# Altium schematic sheet power_supply.SchDoc: Triumvi - Power supply
size Letter; Author: Ye-Sheng Kuo; Revision: 12; SheetNumber: 2; SheetTotal: 9
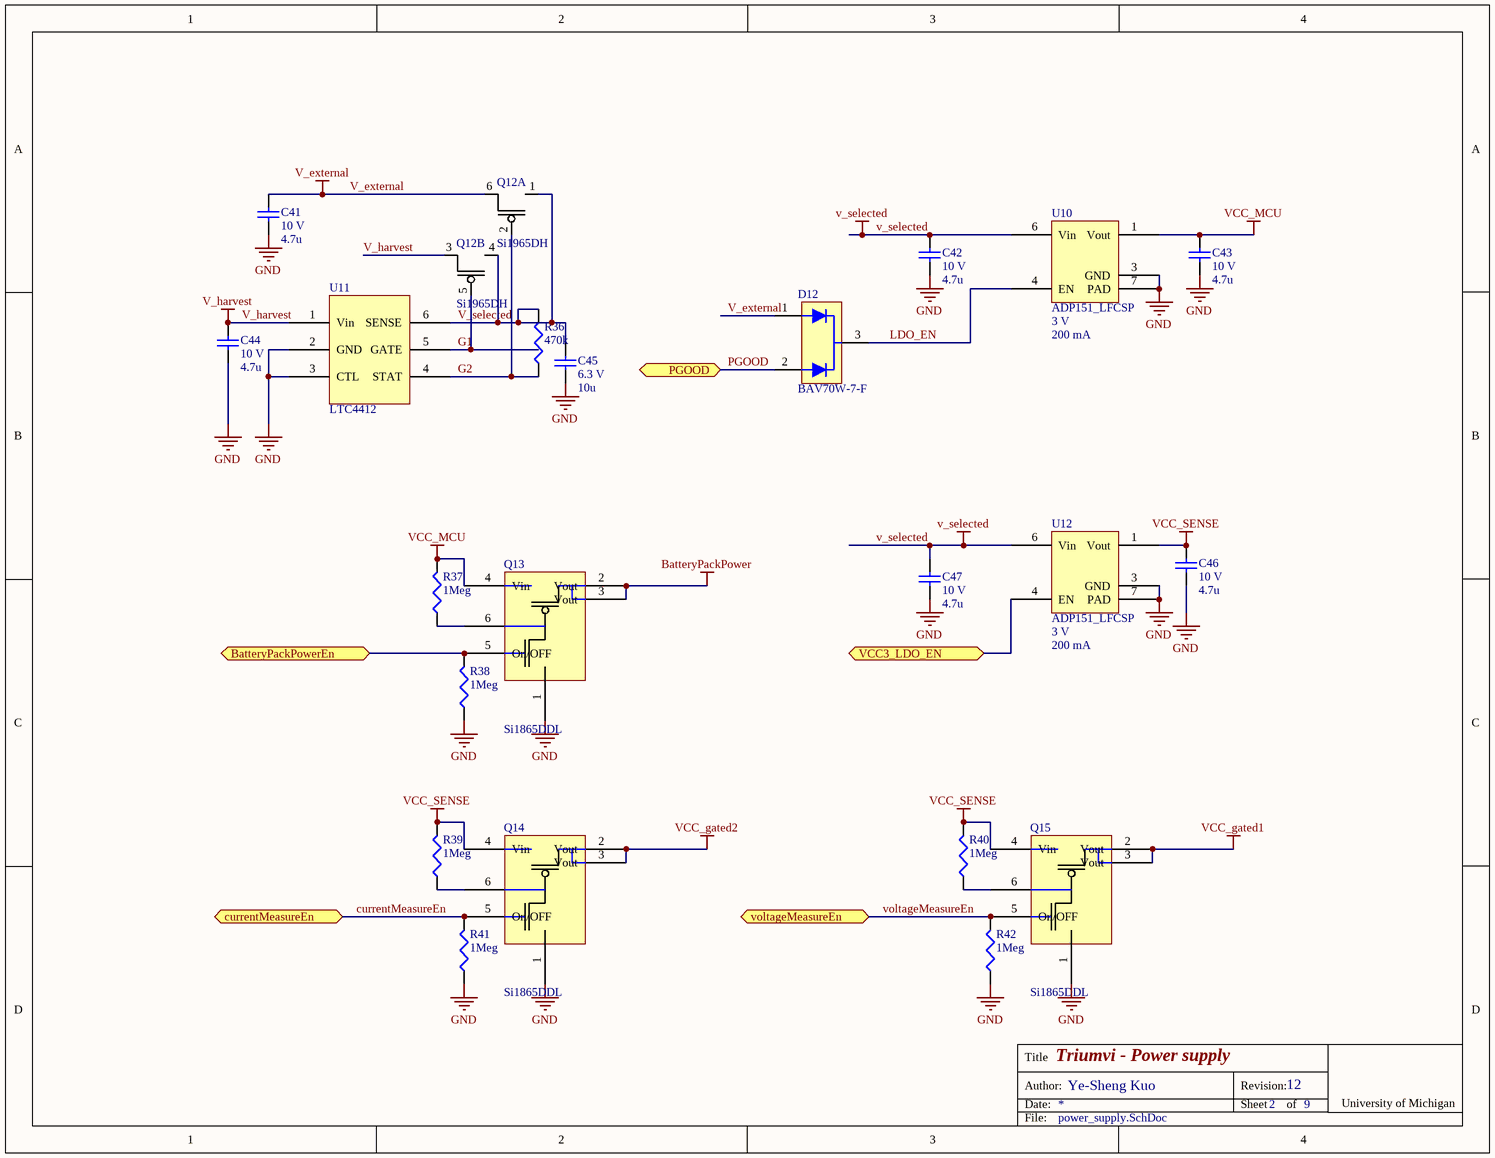
[diagram p0: power_supply.SchDoc]

## Parts
C41  voltage rated: 10 V  [0603]  (hidden comment: 4.7u)
C42  voltage rated: 10 V  [0603]  (hidden comment: 4.7u)
C43  voltage rated: 10 V  [0603]  (hidden comment: 4.7u)
C44  voltage rated: 10 V  [0603]  (hidden comment: 4.7u)
C45  voltage rated: 6.3 V  [0603]  (hidden comment: 10u)
C46  voltage rated: 10 V  [0603]  (hidden comment: 4.7u)
C47  voltage rated: 10 V  [0603]  (hidden comment: 4.7u)
D12  BAV70W-7-F  [SOT323]
Q12  Si1965DH  [SC70-6]  (parts A,B of 2)
Q13  Si1865DDL  [SC70-6]
Q14  Si1865DDL  [SC70-6]
Q15  Si1865DDL  [SC70-6]
R36  470k  [0402]
R37  1Meg  [0402]
R38  1Meg  [0402]
R39  1Meg  [0402]
R40  1Meg  [0402]
R41  1Meg  [0402]
R42  1Meg  [0402]
U10  ADP151_LFCSP  Voltage: 3 V  Current: 200 mA  [CP-6-3]
U11  LTC4412  [TSOT-23]
U12  ADP151_LFCSP  Voltage: 3 V  Current: 200 mA  [CP-6-3]

## Ports
BatteryPackPowerEn, currentMeasureEn, PGOOD, VCC3_LDO_EN, voltageMeasureEn

## Nets
BatteryPackPower: Q13.2(Vout) Q13.3(Vout)
GND: C41.2 C42.2 C43.2 C44.2 C45.2 C46.2 C47.2 Q13.1(S1) Q14.1(S1) Q15.1(S1) R38.2 R41.2 R42.2 U10.3(GND) U10.7(PAD) U11.2(GND) U11.3(CTL) U12.3(GND) U12.7(PAD)
V_external: C41.1 D12.1 Q12.6(D1)
V_harvest: C44.1 Q12.3(D2) U11.1(Vin)
v_selected: C42.1 C45.1 C47.1 Q12.1(S1) Q12.4(S2) R36.1 U10.6(Vin) U11.6(SENSE) U12.6(Vin)
VCC_gated1: Q15.2(Vout) Q15.3(Vout)
VCC_gated2: Q14.2(Vout) Q14.3(Vout)
VCC_MCU: C43.1 Q13.4(Vin) R37.1 U10.1(Vout)
VCC_SENSE: C46.1 Q14.4(Vin) Q15.4(Vin) R39.1 R40.1 U12.1(Vout)
BatteryPackPowerEn: Q13.5(On/OFF) R38.1 ; port BatteryPackPowerEn
currentMeasureEn: Q14.5(On/OFF) R41.1 ; port currentMeasureEn
G1: Q12.5(G2) U11.5(GATE)
G2: Q12.2(G1) R36.2 U11.4(STAT)
LDO_EN: D12.3 U10.4(EN)
PGOOD: D12.2 ; port PGOOD
VCC3_LDO_EN: U12.4(EN) ; port VCC3_LDO_EN
voltageMeasureEn: Q15.5(On/OFF) R42.1 ; port voltageMeasureEn
NetQ13_6: Q13.6(D1) R37.2
NetQ14_6: Q14.6(D1) R39.2
NetQ15_6: Q15.6(D1) R40.2

## Notes on the sheet
- Title
- Date:
- Author:
- Revision:
- Sheet
- of
- University of Michigan
- File:

## Library data of the parts
C41-C44 C46 C47 = CGB3B1X5R1A475K055AC: 4.7µF ±10% 10V Ceramic Capacitor X5R 0603; Manufacture: TDK; tolerance: 10%; package: 0603; Supplier 1: Digi-Key; Supplier Part Number 1: 445-7482-1-ND; Value: 4.7u; Temperature Coefficient: X5R; Manufacturer Part Number: CGB3B1X5R1A475K055AC
C45 = C1608X5R0J106M080AB: 10µF ±20% 6.3V Ceramic Capacitor X5R 0603; Manufacture: TDK; tolerance: 20%; package: 0603; Temperature Coefficient: X5R; Supplier 1: Digi-Key; Supplier Part Number 1: 445-4112-1-ND; Value: 10u; Manufacturer Part Number: C1608X5R0J106M080AB
D12 = BAV70W-7-F: Diode Array 1 Pair Common Cathode Standard 75V 150mA Surface Mount SC-70, SOT-323; Manufacturer: Diodes Incorporated; Forward Voltage @ If: 1.25 V @ 150 mA; Supplier 1: Digi-Key; Supplier Part Number 1: BAV70W-FDICT-ND; Manufacturer Part Number: BAV70W-7-F; current: 150 mA; reverse voltage: 75 V; diode type: Standard
Q12 = Si1965DH: Dual P-Channel 12 V (D-S) MOSFET; Supplier 1: Digi-Key; Supplier Part Number 1: SI1965DH-T1-GE3CT-ND
Q13-Q15 = Si1865DDL: Load Switch with Level-Shift; Supplier 1: Digi-Key; Supplier Part Number 1: SI1865DDL-T1-GE3CT-ND
R36 = CRCW0402470KJNED: RES SMD 470K OHM 5% 1/16W 0402; Manufacturer: Vishay Dale; Temperature Coefficient: 100 ppm/C; Tolerance: 5%; Power: 1/16 W; package: 0402; Supplier 1: Digi-Key; Supplier Part Number 1: 541-470KJCT-ND; value: 470k; Manufacturer Part Number: CRCW0402470KJNED
R37-R42 = CRCW04021M00FKED: RES SMD 1M OHM 1% 1/16W 0402; Manufacturer: Vishay Dale; Temperature Coefficient: 100 ppm/C; Tolerance: 1%; Power: 1/16 W; Supplier 1: Digi-Key; Supplier Part Number 1: 541-1.00MLCT-ND; package: 0402; value: 1Meg; Manufacturer Part Number: CRCW04021M00FKED
U10 U12 = ADP151_LFCSP: Ultralow Noise, 200 mA,  CMOS Linear Regulator; Supplier 1: Digi-Key; Supplier Part Number 1: ADP151ACPZ-3.0-R7CT-ND
U11 = LTC4412: Low Loss PowerPath Controller in ThinSOT; Supplier 1: Digi-Key; Supplier Part Number 1: LTC4412ES6#TRMPBFCT-ND